# EAGLE design maddomat-master (EAGLE 9.6.2)
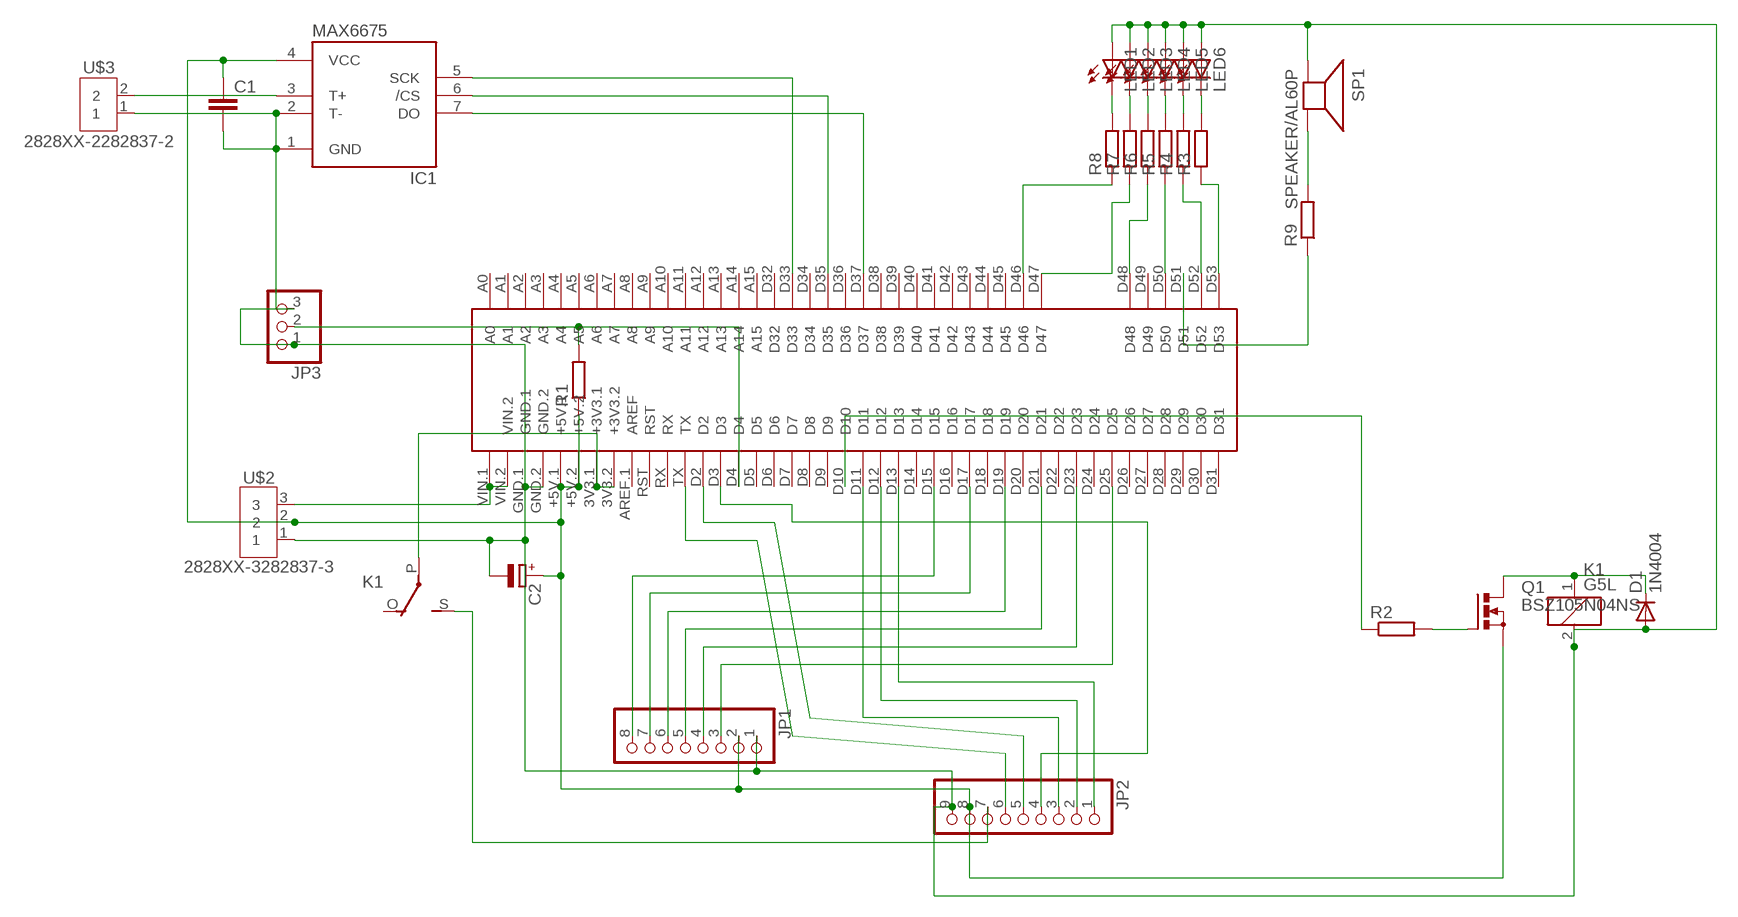
[diagram p0: schematic, sheet 1]

## Parts
C1  C-EUC0805  [C0805]
C2  CPOL-EUE5-10.5  [E5-10,5]
D1  1N4004  [DO41-10]
IC1  MAX6675  [SO08]
JP1  PINHD-1X8  [1X08]
JP2  PINHD-1X9  [1X09]
JP3  PINHD-1X3  [1X03]
K1  G5L  [G5LE]
LED1  LEDCHIP-LED0805  [CHIP-LED0805]
LED2  LEDCHIP-LED0805  [CHIP-LED0805]
LED3  LEDCHIP-LED0805  [CHIP-LED0805]
LED4  LEDCHIP-LED0805  [CHIP-LED0805]
LED5  LEDCHIP-LED0805  [CHIP-LED0805]
LED6  LEDCHIP-LED0805  [CHIP-LED0805]
Q1  BSZ105N04NS  [PG-TDSON-8]
R1  R-EU_M0805  [M0805]
R2  R-EU_M0805  [M0805]
R3  R-EU_M0805  [M0805]
R4  R-EU_M0805  [M0805]
R5  R-EU_M0805  [M0805]
R6  R-EU_M0805  [M0805]
R7  R-EU_M0805  [M0805]
R8  R-EU_M0805  [M0805]
R9  R-EU_M0805  [M0805]
SP1  SPEAKER/AL60P  [AL60P]
U$1  MEGA2560_MIKRO  [MEGA2560_MIKRO]
U$2  2828XX-3282837-3  [TERMBLK_508-3N]
U$3  2828XX-2282837-2  [TERMBLK_508-2N]

## Nets
N$1: U$1.VIN.1 U$1.VIN.2 U$2.3
N$2: R2.1 U$1.D10
N$3: C1.1 C2.+ IC1.4(VCC) JP1.2 JP2.8 Q1.1(S) Q1.2(S) Q1.3(S) R1.1 U$1.+5V.1 U$1.+5V.2 U$2.2
N$4: K1.P(2:P) U$1.3V3.1(+3V3.1) U$1.3V3.2(+3V3.2)
N$5: JP1.8 U$1.D15
N$6: JP1.7 U$1.D17
N$7: JP1.6 U$1.D19
N$8: JP2.1 U$1.D13
N$9: JP1.5 U$1.D21
N$10: JP1.4 U$1.D23
N$11: JP1.3 U$1.D25
N$12: JP2.2 U$1.D12
N$13: JP2.3 U$1.D11
N$14: JP2.6 U$1.TX
N$15: JP2.5 U$1.D2
N$16: JP2.4 U$1.D3
N$17: JP2.7 K1.S(2:S)
N$18: D1.C K1.1 Q1.5(D) Q1.6(D) Q1.7(D) Q1.8(D) Q1.TH(D)
N$19: Q1.4(G) R2.2
N$20: JP3.2 R1.2 U$1.D4
N$21: C1.2 C2.- D1.A IC1.1(GND) IC1.2(T-) JP1.1 JP2.9 JP3.1 JP3.3 K1.2 LED1.A LED2.A LED3.A LED4.A LED5.A LED6.A SP1.1(+) U$1.GND.1 U$1.GND.2 U$2.1 U$3.1
N$22: R3.1 U$1.D53
N$23: R4.1 U$1.D52
N$24: R5.1 U$1.D50
N$25: R6.1 U$1.D48
N$26: R7.1 U$1.D47
N$27: R8.1 U$1.D46
N$28: LED1.C R8.2
N$29: LED2.C R7.2
N$30: LED3.C R6.2
N$31: LED4.C R5.2
N$32: LED5.C R4.2
N$33: LED6.C R3.2
N$34: IC1.3(T+) U$3.2
N$35: IC1.5(SCK) U$1.D33
N$36: IC1.6(/CS) U$1.D35
N$37: IC1.7(DO) U$1.D37
N$38: R9.1 U$1.D51
N$39: R9.2 SP1.2(-)
Unconnected: K1.O(2:O) U$1.A0 U$1.A1 U$1.A2 U$1.A3 U$1.A4 U$1.A5 U$1.A6 U$1.A7 U$1.A8 U$1.A9 U$1.A10 U$1.A11 U$1.A12 U$1.A13 U$1.A14 U$1.A15 U$1.AREF.1(AREF) U$1.D5 U$1.D6 U$1.D7 U$1.D8 U$1.D9 U$1.D14 U$1.D16 U$1.D18 U$1.D20 U$1.D22 U$1.D24 U$1.D26 U$1.D27 U$1.D28 U$1.D29 U$1.D30 U$1.D31 U$1.D32 U$1.D34 U$1.D36 U$1.D38 U$1.D39 U$1.D40 U$1.D41 U$1.D42 U$1.D43 U$1.D44 U$1.D45 U$1.D49 U$1.RST U$1.RX

## Library data of the parts
C1 = rcl_vlastni:C-EU: CAPACITOR, European symbol; SPICEPREFIX: C
C2 = rcl:CPOL-EU: POLARIZED CAPACITOR, European symbol; SPICEPREFIX: C
D1 = adafruit:1N4004: DIODE General purpose 1N400x type rectifier (With bigger pads) http://www.ladyada.net/library/pcb/eaglelibrary.html
IC1 = adafruit:MAX6675
JP1 = pinhead:PINHD-1X8: PIN HEADER
JP2 = pinhead:PINHD-1X9: PIN HEADER
JP3 = pinhead:PINHD-1X3: PIN HEADER
K1 = relay:G5L: RELAY 1 x switch, 10 A/120 V AC, 8 A/30 V ADC, Omron; OC_FARNELL: unknown; OC_NEWARK: unknown
LED1-LED6 = adafruit:LED: LED OSRAM: - CHIPLED LG R971, LG N971, LY N971, LG Q971, LY Q971, LO R971, LY R971 LH N974, LH R974 LS Q976, LO Q976, LY Q976 LO Q996 - Hyper CHIPLED LW Q18S LB Q993, LB Q99A, LB R99A - SideLED LS A670, LO A670, LY A670, LG A670, LP A670 LB A673, LV A673, LT A673, LW A673 LH A674 LY A675 LS A676, LA A676, LO A676, LY A676, LW A676 LS A679, LY A679, LG A679 - Hyper Micro SIDELED® LS Y876, LA Y876, LO Y876, LY Y876 LT Y87S - SmartLED LW L88C, LW L88S LB L89C, LB L89S, LG L890 LS L89K, LO L89K, LY L89K LS L896, LA L896, LO L896, LY L896 - TOPLED LS T670, LO T670, LY T670, LG T670, LP T670 LSG T670, LSP T670, LSY T670, LOP T670, LYG T670 LG T671, LOG T671, LSG T671 LB T673, LV T673, LT T673, LW T673 LH T674 LS T676, LA T676, LO T676, LY T676, LB T676, LH T676, LSB T676, LW T676 LB T67C, LV T67C, LT T67C, LS T67K, LO T67K, LY T67K, LW E67C LS E67B, LA E67B, LO E67B, LY E67B, LB E67C, LV E67C, LT E67C LW T67C LS T679, LY T679, LG T679 LS T770, LO T770, LY T770, LG T770, LP T770 LB T773, LV T773, LT T773, LW T773 LH T774 LS E675, LA E675, LY E675, LS T675 LS T776, LA T776, LO T776, LY T776, LB T776 LHGB T686 LT T68C, LB T68C - Hyper Mini TOPLED® LB M676 - Mini TOPLED Santana® LG M470 LS M47K, LO M47K, LY M47K Source: http://www.osram.convergy.de/
Q1 = transistor-power:BSZ105N04NS: OptiMOS (TM)3 Power-Transistor N-Channel, Normal level Source : Data sheet <http://www.infineon.com/dgdl/BSZ105N04NSG_rev1.1.pdf?folderId=db3a3043156fd5730115c7d50620107c&fileId=db3a30431689f4420116c485c67f084e>
R1-R9 = rcl_vlastni:R-EU_: RESISTOR, European symbol; SPICEPREFIX: R
SP1 = adafruit:SPEAKER: SPEAKER Source: Buerklin Added PS12 (for part # PS1240 piezo) http://www.ladyada.net/library/pcb/eaglelibrary.html
U$1 = MIKRO_MEGA2560:MEGA2560_MIKRO: Arduino Mega2560 pro robotDyn, create by mikroavr.com
U$2 = Connector:2828XX-3: 3 Position Wire to Board Terminal Block Horizontal with Board Datasheet <https://www.te.com.cn/commerce/DocumentDelivery/DDEController?Action=showdoc&DocId=Catalog+Section%7F1308389_EUROSTYLE_TERMINAL_BLOCKS%7F0607%7Fpdf%7FEnglish%7FENG_CS_1308389_EUROSTYLE_TERMINAL_BLOCKS_0607.pdf%7F2-282837-5>; CATEGORY: Connector; DESCRIPTION: TERM BLK 3P SIDE ENT 5.08mm PCB; MANUFACTURER: TE Connectivity; MPN: 282837-3; OPERATING_TEMPERATURE: -40°C to +105°C; PART_STATUS: Active; ROHS_COMPLIANCE: RoHS Compliant; SERIES: 282837; SUBCATEGORY: Terminal Block; TYPE: Side Wire Entry
U$3 = Connector:2828XX-2: 2 Position Wire to Board Terminal Block Horizontal with Board Datasheet <https://www.te.com.cn/commerce/DocumentDelivery/DDEController?Action=showdoc&DocId=Catalog+Section%7F1308389_EUROSTYLE_TERMINAL_BLOCKS%7F0607%7Fpdf%7FEnglish%7FENG_CS_1308389_EUROSTYLE_TERMINAL_BLOCKS_0607.pdf%7F2-282837-5>; CATEGORY: Connector; DESCRIPTION: 2 Position Wire to Board Terminal Block Horizontal with Board 5.08 mm Through Hole; MANUFACTURER: TE Connectivity; MPN: 282837-2; OPERATING_TEMPERATURE: -40°C to +105°C; PART_STATUS: ACTIVE; ROHS_COMPLIANCE: RoHS Compliant; SERIES: 282837; SUBCATEGORY: Terminal Block; TYPE: Side Wire Entry

## Board
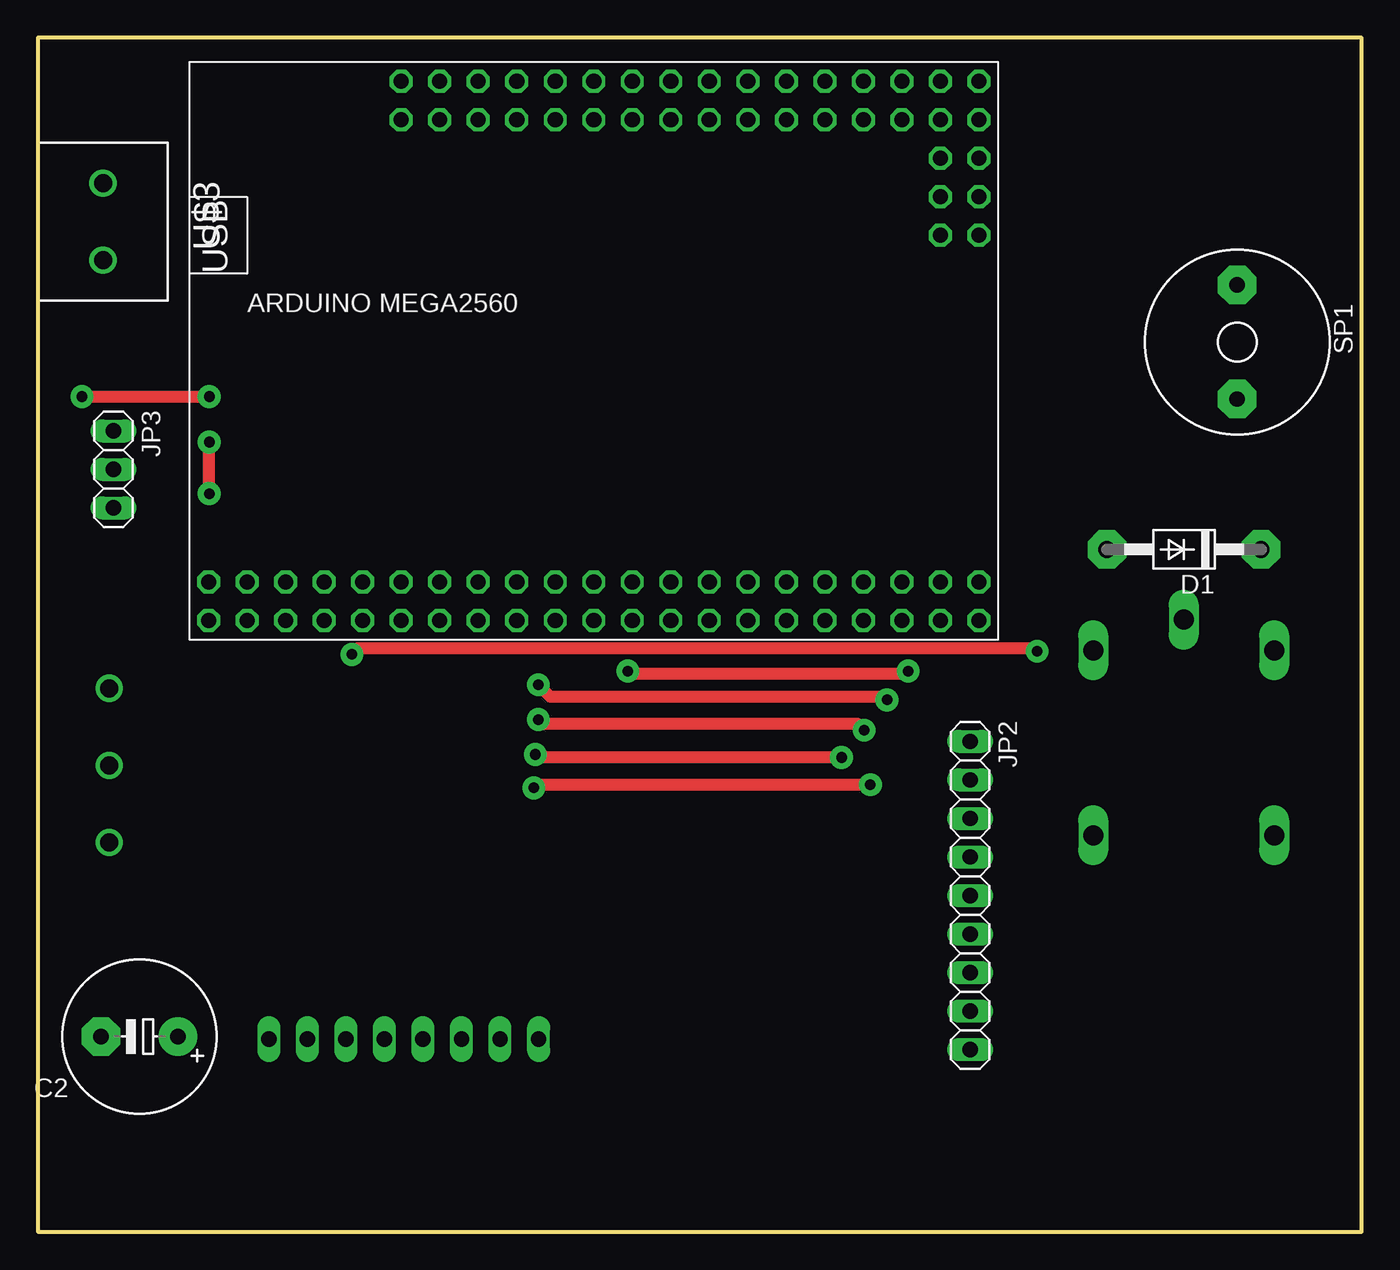
[diagram p1: board, top side]
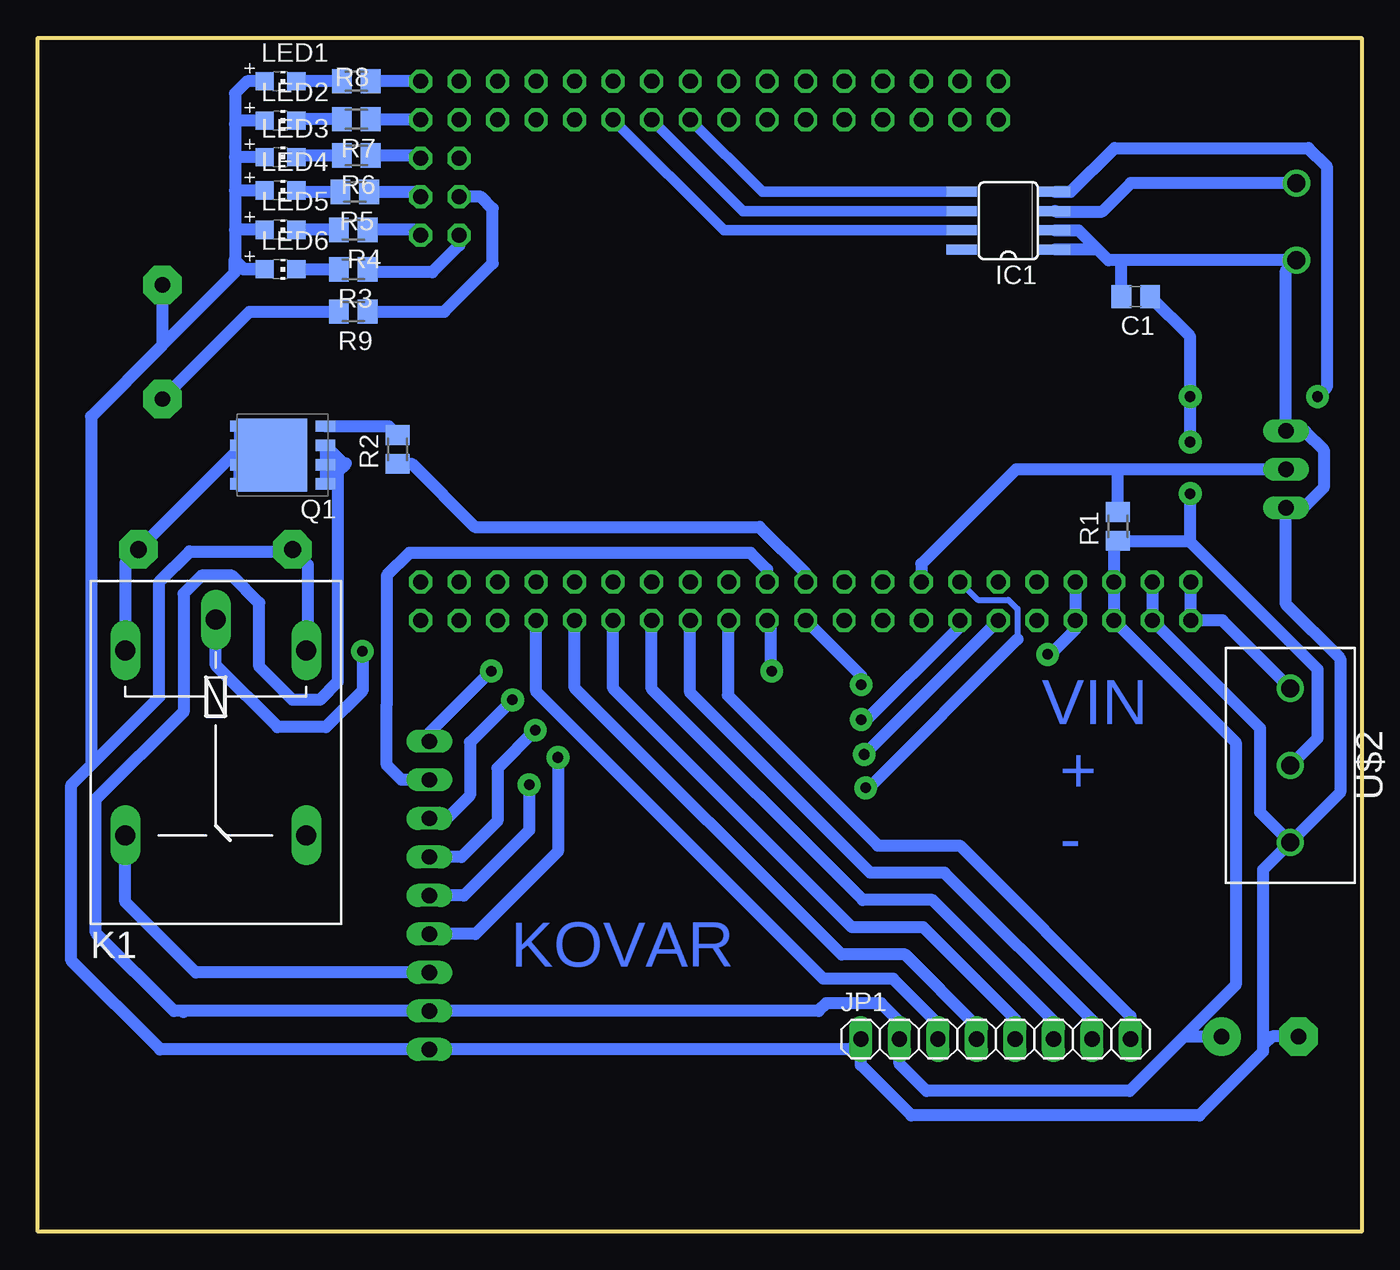
[diagram p2: board, bottom side, seen from below]

Size 87.3 x 78.73 mm. Coordinates in mm from the lower left corner, seen from the top.
Outline: 0,0 87.3,0 87.3,78.73 0,78.73 0,0
Copper layers (1*16): Top 0.035mm / dielectric 1.5mm / Bottom 0.035mm
Design rules "default": minimum track width 6mil, minimum drill 0.35mm, track to track 6mil, track to pad 6mil, pad to pad 6mil, via to via 6mil, smd to smd 6mil, copper to edge 40mil, drill to drill 6mil, minimum pad ring 10mil, minimum via ring 8mil, stop-mask expansion 4mil, vias tented up to drill 0mil, thermal gap 10mil

### Footprints (pad centres in the part's own frame; a part is rotated, then mirrored left to right if it is on the bottom)
C0805 = smd 1.3 x 1.5: 1 -0.95,0; 2 0.95,0
E5-10,5 = drill 1.016 pad 2.54: + -2.54,0 | drill 1.016 pad 2.54 octagon: - 2.54,0
DO41-10 = drill 1.118 pad 2.54 octagon: A 5.08,0; C -5.08,0
SO08 = smd 0.66 x 2.032: 1 -1.905,-3.073; 2 -0.635,-3.073; 3 0.635,-3.073; 4 1.905,-3.073; 5 1.905,3.073; 6 0.635,3.073; 7 -0.635,3.073; 8 -1.905,3.073
1X08 = drill 1.016 long: 1 -8.89,0; 2 -6.35,0; 3 -3.81,0; 4 -1.27,0; 5 1.27,0; 6 3.81,0; 7 6.35,0; 8 8.89,0
1X09 = drill 1.016 long: 1 -10.16,0; 2 -7.62,0; 3 -5.08,0; 4 -2.54,0; 5 0,0; 6 2.54,0; 7 5.08,0; 8 7.62,0; 9 10.16,0
1X03 = drill 1.016 long: 1 -2.54,0; 2 0,0; 3 2.54,0
G5LE = drill 1.321 long: 1 -7.493,-5.969; 2 -7.493,5.969; O 4.699,5.969; P -9.525,0; S 4.699,-5.969
CHIP-LED0805 = smd 1.2 x 1.2: A 0,-1.05; C 0,1.05
PG-TDSON-8 = smd 1.3 x 0.75: 1 -2.825,1.905; 2 -2.825,0.635; 3 -2.825,-0.635; 4 -2.825,-1.905; 5 2.825,-1.905; 6 2.825,-0.635; 7 2.825,0.635; 8 2.825,1.905 | smd 4.7 x 4.8: TH 0.725,0
M0805 = smd 1.3 x 1.6: 1 -0.95,0; 2 0.95,0
AL60P = drill 1.016 pad 2.54 octagon: 1 -3.759,0; 2 3.759,0
MEGA2560_MIKRO = drill 1 octagon: 3V3.1 -26.67,-17.78; 3V3.2 -26.67,-20.32; +5V.1 -29.21,-17.78; +5V.2 -29.21,-20.32; A0 -21.59,15.24; A1 -21.59,12.7; A2 -19.05,15.24; A3 -19.05,12.7; A4 -16.51,15.24; A5 -16.51,12.7; A6 -13.97,15.24; A7 -13.97,12.7; A8 -11.43,15.24; A9 -11.43,12.7; A10 -8.89,15.24; A11 -8.89,12.7; A12 -6.35,15.24; A13 -6.35,12.7; A14 -3.81,15.24; A15 -3.81,12.7; AREF.1 -24.13,-17.78; D2 -19.05,-17.78; D3 -19.05,-20.32; D4 -16.51,-17.78; D5 -16.51,-20.32; D6 -13.97,-17.78; D7 -13.97,-20.32; D8 -11.43,-17.78; D9 -11.43,-20.32; D10 -8.89,-17.78; D11 -8.89,-20.32; D12 -6.35,-17.78; D13 -6.35,-20.32; D14 -3.81,-17.78; D15 -3.81,-20.32; D16 -1.27,-17.78; D17 -1.27,-20.32; D18 1.27,-17.78; D19 1.27,-20.32; D20 3.81,-17.78; D21 3.81,-20.32; D22 6.35,-17.78; D23 6.35,-20.32; D24 8.89,-17.78; D25 8.89,-20.32; D26 11.43,-17.78; D27 11.43,-20.32; D28 13.97,-17.78; D29 13.97,-20.32; D30 16.51,-17.78; D31 16.51,-20.32; D32 -1.27,15.24; D33 -1.27,12.7; D34 1.27,15.24; D35 1.27,12.7; D36 3.81,15.24; D37 3.81,12.7; D38 6.35,15.24; D39 6.35,12.7; D40 8.89,15.24; D41 8.89,12.7; D42 11.43,15.24; D43 11.43,12.7; D44 13.97,15.24; D45 13.97,12.7; D46 16.51,15.24; D47 16.51,12.7; D48 16.51,10.16; D49 13.97,10.16; D50 16.51,7.62; D51 13.97,7.62; D52 16.51,5.08; D53 13.97,5.08; GND.1 -31.75,-17.78; GND.2 -31.75,-20.32; RST -24.13,-20.32; RX -21.59,-17.78; TX -21.59,-20.32; VIN.1 -34.29,-17.78; VIN.2 -34.29,-20.32
TERMBLK_508-3N = drill 1.2: 1 0,0; 2 5.08,0; 3 10.16,0
TERMBLK_508-2N = drill 1.2: 1 0,0; 2 5.08,0

### Placement (x,y rotation side)
C1  14.9,61.67 180 bottom
C2  6.7,12.87 180 top
D1  75.59,44.99 180 top
IC1  23.3,66.67 90 bottom
JP1  24.13,12.7 0 bottom
JP2  61.49,22.17 270 top
JP3  4.99,50.27 270 top
K1  75.57,30.84 270 bottom
LED1  71.3,75.87 270 bottom
LED2  71.3,73.27 270 bottom
LED3  71.3,70.87 270 bottom
LED4  71.3,68.67 270 bottom
LED5  71.3,66.07 270 bottom
LED6  71.3,63.47 270 bottom
Q1  71.16,51.22 180 bottom
R1  16.07,46.51 90 bottom
R2  63.57,51.59 90 bottom
R3  66.5,63.47 180 bottom
R4  66.5,66.07 180 bottom
R5  66.4,68.57 180 bottom
R6  66.3,70.97 180 bottom
R7  66.3,73.37 180 bottom
R8  66.3,75.87 180 bottom
R9  66.5,60.67 180 bottom
SP1  79.1,58.67 270 top
U$1  45.55,60.63 0 top
U$2  4.7,25.67 90 bottom
U$3  4.3,64.07 90 top

### Tracks (layer width: path | path; a pad name or v marks a point on that pad's centre or on a via)
N$1
  Bottom 0.8: U$1.VIN.1 U$1.VIN.2 9.18,40.31 U$2.3
N$2
  Bottom 0.8: R2.1 62.67,50.64 58.5,46.47 39.7,46.47 36.66,43.43 U$1.D10
N$3  (via drill 0.7 pad 1.5)
  Top 0.8: v11.3,48.67 v11.3,52.07 | v2.9,55.07 v11.3,55.07
  Bottom 0.8: 61.47,14.57 JP2.8 | JP2.8 77.62,14.55 77.7,14.47 | JP2.8 78.32,14.55 83.48,19.71 83.48,28.49 77.7,34.27 77.7,42.07 76.5,43.27 74.5,43.27 72.7,41.47 72.7,37.27 70.5,35.07 68.7,35.07 67.5,36.27 67.5,50.15 | Q1.2 68.25,50.67 66.98,50.67 67.5,50.15 | 67.15,50.67 Q1.3 Q1.1 67.5,50.15 | U$2.2 2.9,32.55 2.9,37.08 11.37,45.55 | 11.37,45.55 R1.1 16.34,45.29 U$1.+5V.1 U$1.+5V.2 8.3,32.27 8.3,16.27 11.7,12.87 | 11.37,45.55 11.3,45.62 v11.3,48.67 | IC1.4 19.2,68.58 16.3,71.47 3.5,71.47 2.3,70.27 2.3,55.67 v2.9,55.07 | v11.3,52.07 v11.3,55.07 11.3,59.02 C1.1 | JP2.8 35.82,14.55 35.3,15.07 31.7,15.07 30.48,13.85 JP1.2 30.48,11.05 28.7,9.27 15.3,9.27 11.7,12.87 | 11.7,12.87 C2.+
N$4  (via drill 0.7 pad 1.5)
  Top 0.8: v20.7,38.07 21.1,38.47 65.7,38.47 v65.9,38.27
  Bottom 0.8: U$1.3V3.1 U$1.3V3.2 18.88,39.71 20.52,38.07 v20.7,38.07 | v65.9,38.27 65.9,35.67 68.3,33.27 71.5,33.27 75.57,37.34 K1.P
N$5
  Bottom 0.8: U$1.D15 41.8,40.25 41.8,35.37 31.9,25.47 26.5,25.47 15.24,14.21 JP1.8
N$6
  Bottom 0.8: U$1.D17 44.28,35.55 32.4,23.67 27.5,23.67 17.7,13.87 17.78,13.79 JP1.7
N$7
  Bottom 0.8: U$1.D19 46.82,35.79 32.9,21.87 28.3,21.87 20.32,13.89 JP1.6
N$8  (via drill 0.7 pad 1.5)
  Top 0.8: v57.4,36.97 57.2,36.77 39.1,36.77 v38.9,36.97
  Bottom 0.8: U$1.D13 39,40.11 39,37.27 38.9,37.17 v38.9,36.97 | JP2.1 61.49,32.88 v57.4,36.97
N$9
  Bottom 0.8: U$1.D21 49.36,35.83 33.6,20.07 28.9,20.07 22.86,14.03 JP1.5
N$10
  Bottom 0.8: U$1.D23 51.9,35.87 34.3,18.27 30.1,18.27 25.4,13.57 JP1.4
N$11
  Bottom 0.8: JP1.3 27.9,12.74 27.9,13.67 30.9,16.67 35.5,16.67 54.44,35.61 U$1.D25
N$12
  Bottom 0.8: U$1.D12 39.2,43.67 40.3,44.77 62.8,44.77 64.3,43.27 64.3,35.27 64.3,34.77 64.3,30.77 63.32,29.79 JP2.2
N$13  (via drill 0.7 pad 1.5)
  Top 0.8: v56,35.07 55.8,35.27 33.8,35.27 v33,36.07
  Bottom 0.8: U$1.D11 33,36.65 v33,36.07 | v56,35.07 58.8,32.27 58.8,28.77 60.32,27.25 JP2.3
N$14  (via drill 0.7 pad 1.5)
  Top 0.8: v53,31.27 33,31.27 v32.8,31.47
  Bottom 0.8: v32.8,31.47 U$1.TX | v53,31.27 53,25.07 58.44,19.63 JP2.6
N$15  (via drill 0.7 pad 1.5)
  Top 0.8: v32.7,29.27 32.9,29.47 v54.9,29.47
  Bottom 0.406: U$1.D2 25.32,41.67 23.3,41.67 22.7,41.07 22.7,39.07
  Bottom 0.8: 22.7,39.07 32.5,29.27 v32.7,29.27 | v54.9,29.47 54.9,26.47 59.2,22.17 JP2.5
N$16  (via drill 0.7 pad 1.5)
  Top 0.8: v54.5,33.07 54.1,33.47 33.3,33.47 v33,33.77
  Bottom 0.8: U$1.D3 26.5,39.91 32.84,33.57 33.2,33.57 v33,33.77 | v54.5,33.07 57,30.57 57,27.07 59.36,24.71 JP2.4
N$17
  Bottom 0.8: JP2.7 76.89,17.09 81.54,21.74 K1.S
N$18
  Bottom 0.8: K1.1 81.54,44.12 D1.C 74.44,51.22 Q1.TH 72.08,51.22 Q1.8 Q1.7 Q1.6 Q1.5
N$19
  Bottom 0.8: Q1.4 64.16,53.12 R2.2
N$20
  Bottom 0.8: JP3.2 16.3,50.27 | 16.3,50.27 22.8,50.27 29.04,44.03 U$1.D4 | R1.2 16.07,50.04 16.3,50.27
N$21
  Bottom 0.8: JP2.9 61.45,11.97 | K1.2 69.51,38.42 69.51,43.99 D1.A 70.63,44.87 77.3,44.87 79.3,42.87 79.3,35.27 83.8,30.77 | JP2.9 79.24,12.01 85.1,17.87 85.1,29.47 83.8,30.77 | LED1.A 73.5,75.87 74.3,75.07 74.3,73.07 | 74.3,73.07 74.3,70.87 | 74.3,70.87 74.3,68.67 | 74.3,68.67 74.3,66.07 | 74.3,66.07 74.3,64.07 73.7,63.47 LED6.A 73.75,63.47 74.35,64.07 74.35,63.22 79.1,58.47 | LED5.A 74.3,66.07 | LED4.A 74.3,68.67 | LED3.A 74.3,70.87 | LED2.A 74.1,73.27 74.3,73.07 | 83.8,30.77 83.8,53.77 79.1,58.47 | U$1.GND.1 U$1.GND.2 6.7,33.21 6.7,27.67 U$2.1 | 15.9,64.07 U$3.1 4.99,63.38 JP3.1 4.95,52.77 3.7,52.77 2.5,51.57 2.5,49.07 3.84,47.73 JP3.3 4.99,41.36 1.42,37.79 1.42,28.95 U$2.1 | 15.9,64.07 16.7,64.07 17.39,64.77 | 17.39,64.77 IC1.1 | IC1.2 18.66,66.03 17.39,64.77 | C1.2 15.85,64.02 15.9,64.07 | JP2.9 33.71,12.01 JP1.1 33.02,10.99 29.7,7.67 10.7,7.67 6.5,11.87 6.5,12.27 | U$2.1 6.5,23.87 6.5,12.27 | SP1.1 79.1,58.47 | C2.- 5.9,12.87 6.5,12.27
N$22
  Bottom 0.8: U$1.D53 59.52,65.05 61.3,63.27 65.35,63.27 R3.1
N$23
  Bottom 0.8: U$1.D52 62.42,66.07 R4.1
N$24
  Bottom 0.8: U$1.D50 62.38,68.57 R5.1
N$25
  Bottom 0.8: U$1.D48 62.24,70.97 R6.1
N$26
  Bottom 0.8: U$1.D47 65.31,73.33 R7.1
N$27
  Bottom 0.8: U$1.D46 R8.1
N$28
  Bottom 0.8: R8.2 LED1.C
N$29
  Bottom 0.8: R7.2 70.15,73.37 LED2.C
N$30
  Bottom 0.8: R6.2 70.15,70.97 LED3.C
N$31
  Bottom 0.8: R5.2 70.15,68.57 LED4.C
N$32
  Bottom 0.8: R4.2 LED5.C
N$33
  Bottom 0.8: LED6.C R3.2
N$34
  Bottom 0.8: U$3.2 15.22,69.15 17.1,67.27 20.19,67.27 IC1.3
N$35
  Bottom 0.7: IC1.5 39.53,68.58 U$1.D33
N$36
  Bottom 0.7: IC1.6 40.8,67.3 U$1.D35
N$37
  Bottom 0.7: U$1.D37 42.06,66.03 IC1.7
N$38
  Bottom 0.8: U$1.D51 58.08,68.25 57.3,67.47 57.3,63.87 60.5,60.67 R9.1
N$39
  Bottom 0.8: SP1.2 73.34,60.67 R9.2

### Text on the board
Bottom: VIN / + / - | KOVAR